# Altium schematic sheet AYBR3000.SchDoc
size A2
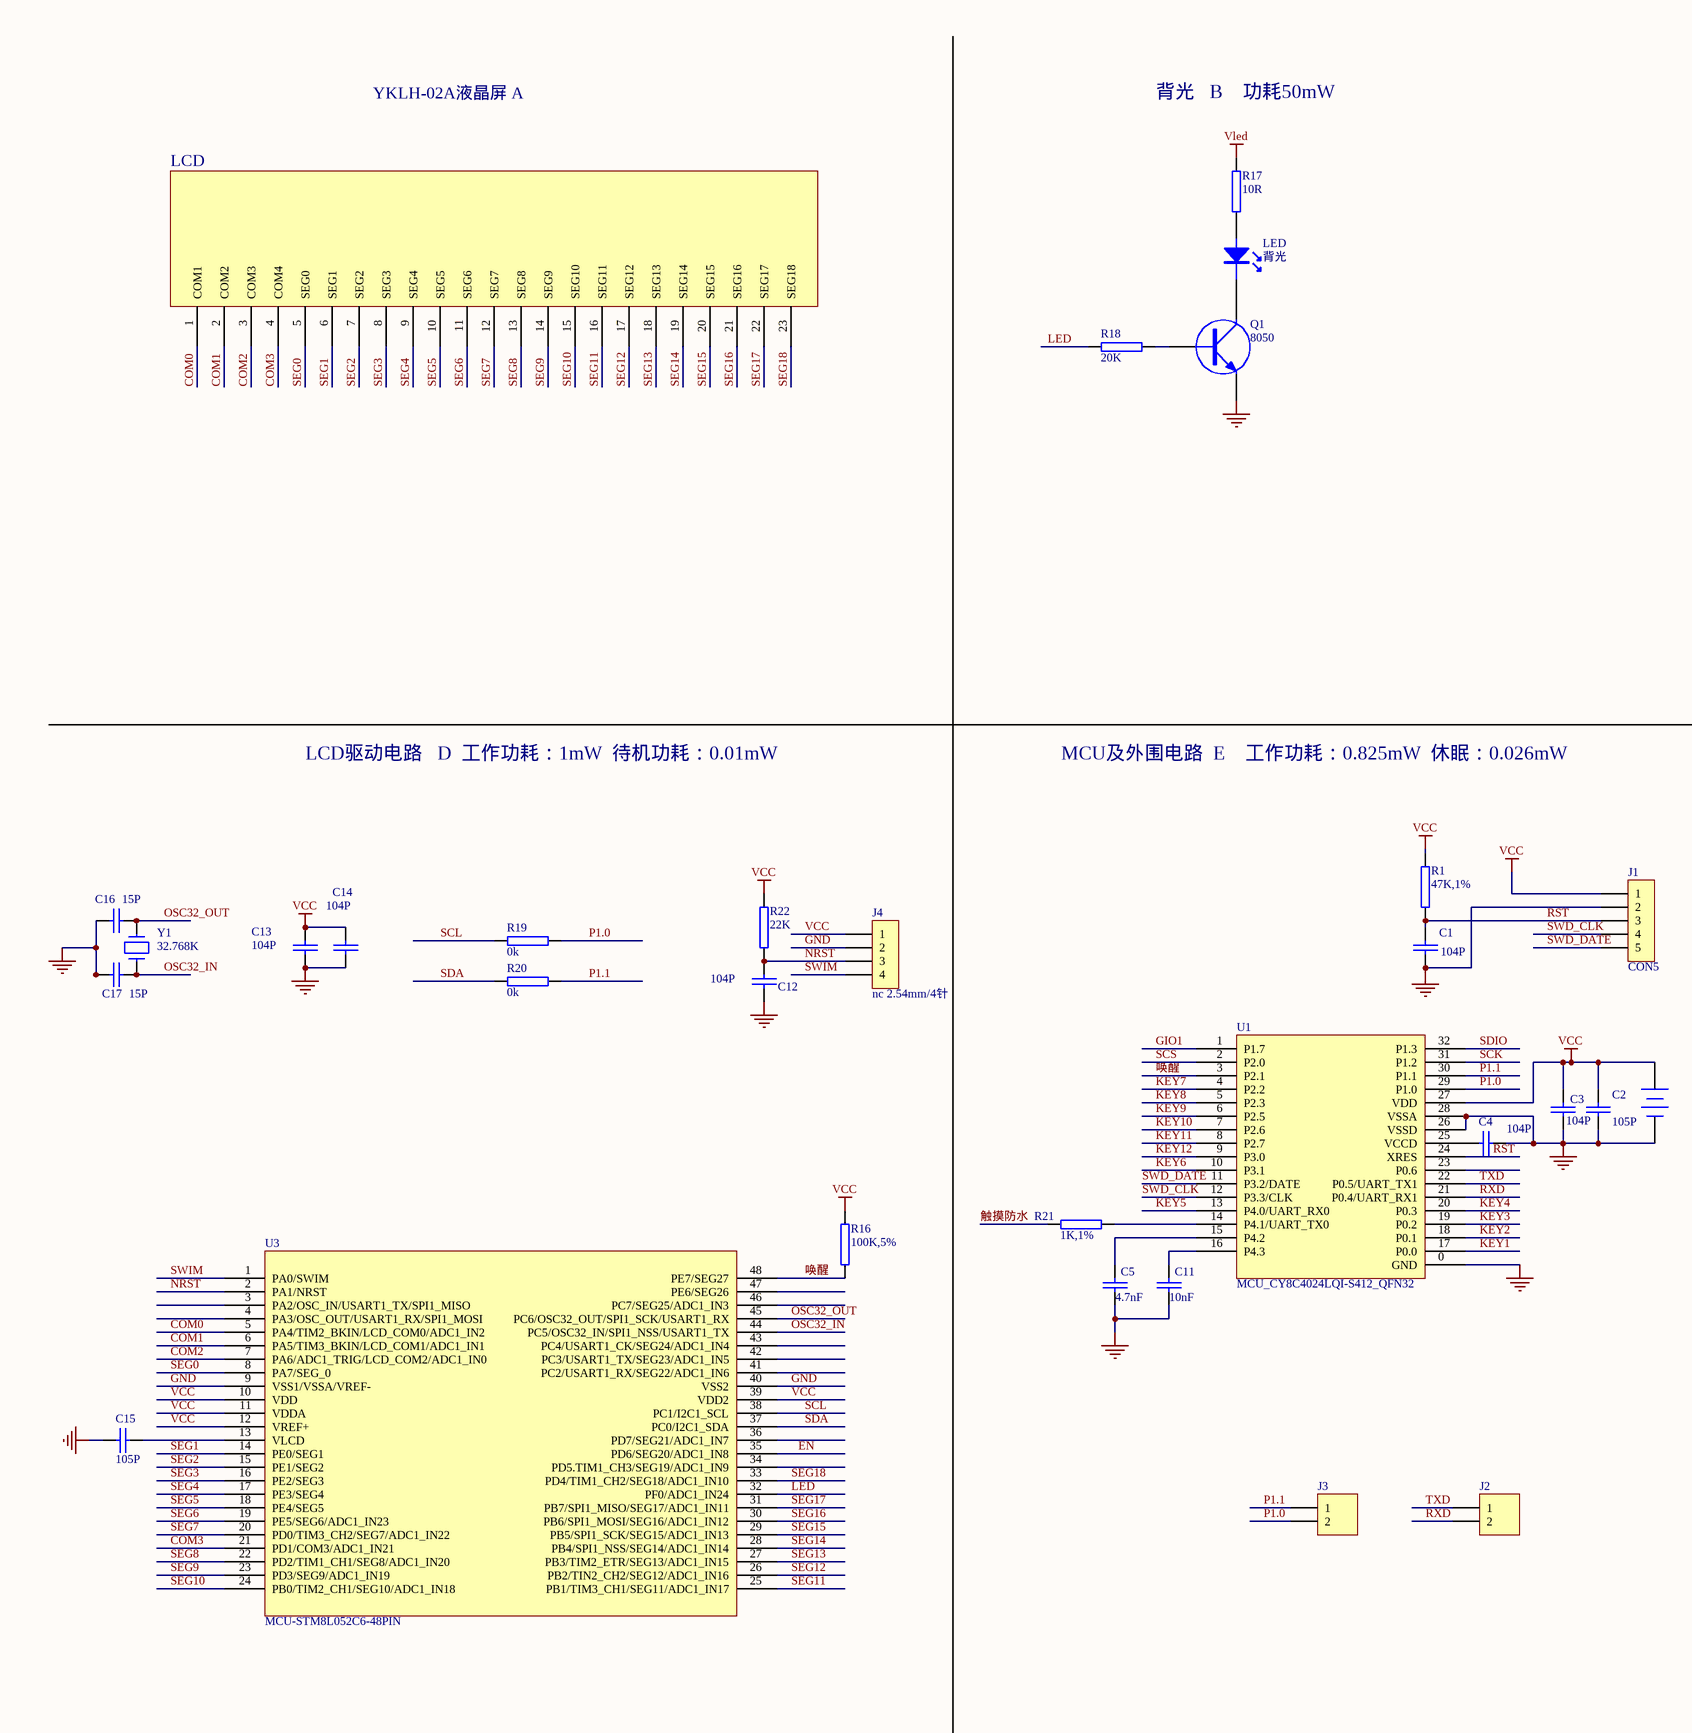
[diagram p0: AYBR3000.SchDoc, left]
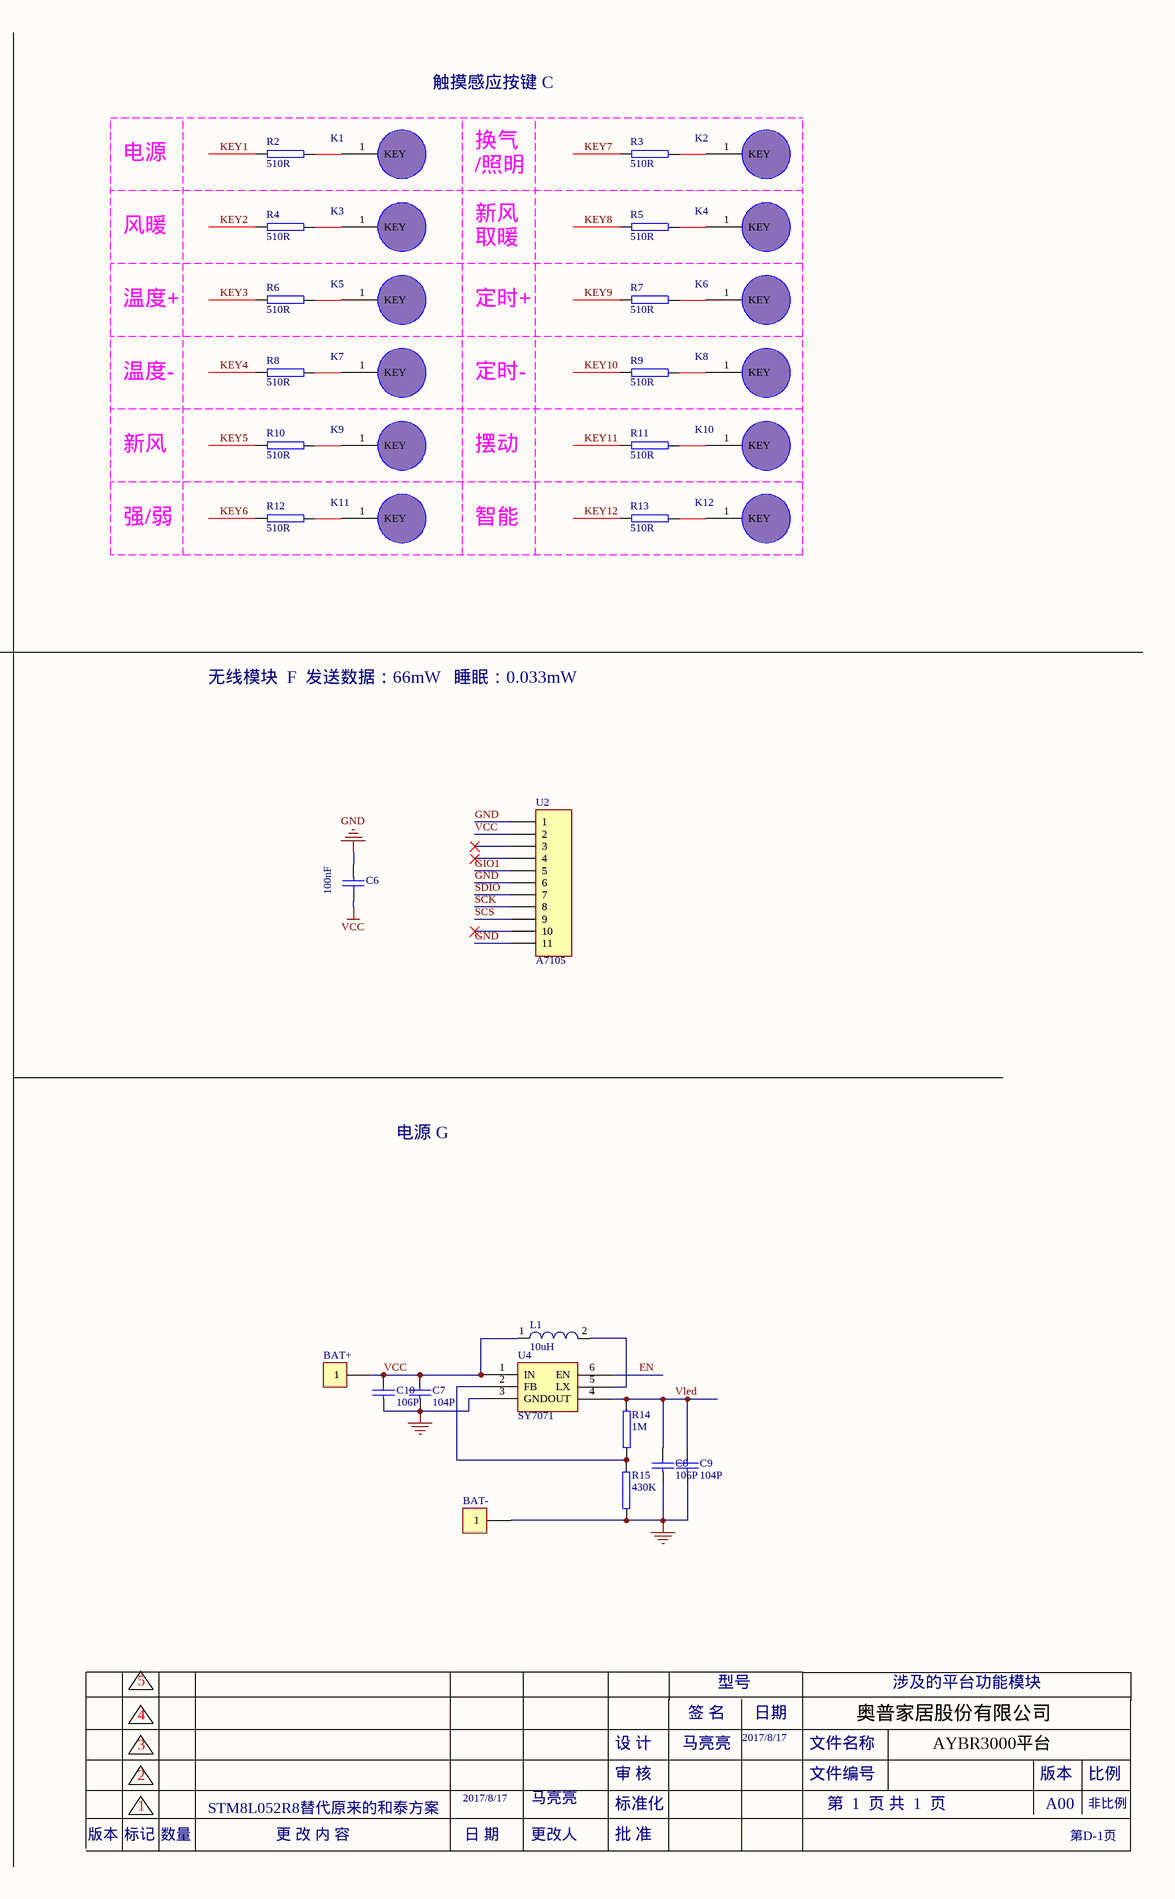
[diagram p1: AYBR3000.SchDoc, right]

## Parts
?  (no value)  [BAT-2]
BAT+  NC  [DOT]  (value not drawn)
BAT-  NC  [DOT]  (value not drawn)
C1  104P  [C0603-T]
C2  105P  [C0603-T]
C3  104P  [C0603-T]
C4  104P  [C0603-T]
C5  4.7nF  [C0603-T]
C6  100nF  [C0603-G]
C7  104P  [C0603-T]
C8  106P  [C0805-T]
C9  104P  [C0603-T]
C10  106P  [C0805-T]
C11  10nF  [C0603-T]
C12  104P  [0603]
C13  104P  [0603]
C14  104P  [0603]
C15  105P  [0603]
C16  15P  [0603]
C17  15P  [0603]
J1  CON5  [PZ-1*5-M-DO]
J2  (no value)  [SIP-2_54-2P]
J3  (no value)  [SIP-2_54-2P]
J4  nc 2.54mm/4针  [PZ-4]
K1  (no value)  [GYTH-YKLH-02A]
K2  (no value)  [GYTH-YKLH-02A]
K3  (no value)  [GYTH-YKLH-02A]
K4  (no value)  [GYTH-YKLH-02A]
K5  (no value)  [GYTH-YKLH-02A]
K6  (no value)  [GYTH-YKLH-02A]
K7  (no value)  [GYTH-YKLH-02A]
K8  (no value)  [GYTH-YKLH-02A]
K9  (no value)  [GYTH-YKLH-02A]
K10  (no value)  [GYTH-YKLH-02A]
K11  (no value)  [GYTH-YKLH-02A]
K12  (no value)  [GYTH-YKLH-02A]
L1  10uH  [L-2.0]
LCD  YKLH-02A液晶屏 A  [LCD-YKLH-02A]
LED  背光  [BLK-YKLH-02A-2]
Q1  8050  [SOT23-BEC-G]
R1  47K,1%  [R0603-T]
R2  510R  [R0603-T]
R3  510R  [R0603-T]
R4  510R  [R0603-T]
R5  510R  [R0603-T]
R6  510R  [R0603-T]
R7  510R  [R0603-T]
R8  510R  [R0603-T]
R9  510R  [R0603-T]
R10  510R  [R0603-T]
R11  510R  [R0603-T]
R12  510R  [R0603-T]
R13  510R  [R0603-T]
R14  1M  [R0603-T]
R15  430K  [R0603-T]
R16  100K,5%  [R0603-T]
R17  10R  [R1206-T]
R18  20K  [C0603-T]
R19  0k  [R0603-T]
R20  0k  [R0603-T]
R21  1K,1%  [R0603-T]
R22  22K  [0603]
U1  MCU_CY8C4024LQI-S412_QFN32  [QFN32-5*5]
U2  A7105  [MD7105-A04]
U3  MCU-STM8L052C6-48PIN  [LQFP48]
U4  SY7071  [SOT363]
Y1  32.768K  [XD-32.768K]

## Nets
GND: ?.2(-) BAT-.1 C1.2 C2.1 C3.1 C4.1 C5.1 C6.1 C7.1 C8.1 C9.1 C10.1 C11.1 C12.1 C13.1 C14.1 C15.2 C16.1 C17.1 J1.2 J4.2 Q1.E R15.1 U1.0(GND) U1.26(VSSD) U1.28(VSSA) U2.1 U2.6 U2.11 U3.9(VSS1/VSSA/VREF-) U3.40(VSS2) U4.3(GND)
VCC: ?.1(+) BAT+.1 C2.2 C3.2 C6.2 C7.2 C10.2 C13.2 C14.2 J1.1 J4.1 L1.1 R1.2 R16.1 R22.2 U1.27(VDD) U2.2 U3.10(VDD) U3.11(VDDA) U3.12(VREF+) U3.39(VDD2) U4.1(IN)
Vled: C8.2 C9.2 R14.1 R17.2 U4.4(OUT)
COM0: LCD.1(COM1) U3.5(PA4/TIM2_BKIN/LCD_COM0/ADC1_IN2)
COM1: LCD.2(COM2) U3.6(PA5/TIM3_BKIN/LCD_COM1/ADC1_IN1)
COM2: LCD.3(COM3) U3.7(PA6/ADC1_TRIG/LCD_COM2/ADC1_IN0)
COM3: LCD.4(COM4) U3.21(PD1/COM3/ADC1_IN21)
EN: U3.35(PD6/SEG20/ADC1_IN8) U4.6(EN)
GIO1: U1.1(P1.7) U2.5
KEY1: R2.2 U1.17(P0.0)
KEY2: R4.2 U1.18(P0.1)
KEY3: R6.2 U1.19(P0.2)
KEY4: R8.2 U1.20(P0.3)
KEY5: R10.2 U1.13(P4.0/UART_RX0)
KEY6: R12.2 U1.10(P3.1)
KEY7: R3.2 U1.4(P2.2)
KEY8: R5.2 U1.5(P2.3)
KEY9: R7.2 U1.6(P2.5)
KEY10: R9.2 U1.7(P2.6)
KEY11: R11.2 U1.8(P2.7)
KEY12: R13.2 U1.9(P3.0)
LED: R18.2 U3.32(PF0/ADC1_IN24)
NRST: C12.2 J4.3 R22.1 U3.2(PA1/NRST)
OSC32_IN: C17.2 U3.44(PC5/OSC32_IN/SPI1_NSS/USART1_TX) Y1.2
OSC32_OUT: C16.2 U3.45(PC6/OSC32_OUT/SPI1_SCK/USART1_RX) Y1.1
P1.0: J3.2 R19.1 U1.29(P1.0)
P1.1: J3.1 R20.1 U1.30(P1.1)
RST: C1.1 J1.3 R1.1 U1.24(XRES)
RXD: J2.2 U1.21(P0.4/UART_RX1)
SCK: U1.31(P1.2) U2.8
SCL: R19.2 U3.38(PC1/I2C1_SCL)
SCS: U1.2(P2.0) U2.9
SDA: R20.2 U3.37(PC0/I2C1_SDA)
SDIO: U1.32(P1.3) U2.7
SEG0: LCD.5(SEG0) U3.8(PA7/SEG_0)
SEG1: LCD.6(SEG1) U3.14(PE0/SEG1)
SEG2: LCD.7(SEG2) U3.15(PE1/SEG2)
SEG3: LCD.8(SEG3) U3.16(PE2/SEG3)
SEG4: LCD.9(SEG4) U3.17(PE3/SEG4)
SEG5: LCD.10(SEG5) U3.18(PE4/SEG5)
SEG6: LCD.11(SEG6) U3.19(PE5/SEG6/ADC1_IN23)
SEG7: LCD.12(SEG7) U3.20(PD0/TIM3_CH2/SEG7/ADC1_IN22)
SEG8: LCD.13(SEG8) U3.22(PD2/TIM1_CH1/SEG8/ADC1_IN20)
SEG9: LCD.14(SEG9) U3.23(PD3/SEG9/ADC1_IN19)
SEG10: LCD.15(SEG10) U3.24(PB0/TIM2_CH1/SEG10/ADC1_IN18)
SEG11: LCD.16(SEG11) U3.25(PB1/TIM3_CH1/SEG11/ADC1_IN17)
SEG12: LCD.17(SEG12) U3.26(PB2/TIN2_CH2/SEG12/ADC1_IN16)
SEG13: LCD.18(SEG13) U3.27(PB3/TIM2_ETR/SEG13/ADC1_IN15)
SEG14: LCD.19(SEG14) U3.28(PB4/SPI1_NSS/SEG14/ADC1_IN14)
SEG15: LCD.20(SEG15) U3.29(PB5/SPI1_SCK/SEG15/ADC1_IN13)
SEG16: LCD.21(SEG16) U3.30(PB6/SPI1_MOSI/SEG16/ADC1_IN12)
SEG17: LCD.22(SEG17) U3.31(PB7/SPI1_MISO/SEG17/ADC1_IN11)
SEG18: LCD.23(SEG18) U3.33(PD4/TIM1_CH2/SEG18/ADC1_IN10)
SWD_CLK: J1.4 U1.12(P3.3/CLK)
SWD_DATE: J1.5 U1.11(P3.2/DATE)
SWIM: J4.4 U3.1(PA0/SWIM)
TXD: J2.1 U1.22(P0.5/UART_TX1)
唤醒: R16.2 U1.3(P2.1) U3.48(PE7/SEG27)
触摸防水: R21.2
NetC4_2: C4.2 U1.25(VCCD)
NetC5_2: C5.2 U1.15(P4.2)
NetC11_2: C11.2 U1.16(P4.3)
NetC15_1: C15.1 U3.13(VLCD)
NetK1_1: K1.1(KEY) R2.1
NetK2_1: K2.1(KEY) R3.1
NetK3_1: K3.1(KEY) R4.1
NetK4_1: K4.1(KEY) R5.1
NetK5_1: K5.1(KEY) R6.1
NetK6_1: K6.1(KEY) R7.1
NetK7_1: K7.1(KEY) R8.1
NetK8_1: K8.1(KEY) R9.1
NetK9_1: K9.1(KEY) R10.1
NetK10_1: K10.1(KEY) R11.1
NetK11_1: K11.1(KEY) R12.1
NetK12_1: K12.1(KEY) R13.1
NetL1_2: L1.2 U4.5(LX)
NetLED_A: LED.A R17.1
NetLED_K: LED.K Q1.C
NetQ1_B: Q1.B R18.1
NetR14_2: R14.2 R15.2 U4.2(FB)
NetR21_1: R21.1 U1.14(P4.1/UART_TX0)

Not connected (* = marked no-connect by the designer): U1 23(P0.6); U2 3* 4* 10*; U3 3(PA2/OSC_IN/USART1_TX/SPI1_MISO) 4(PA3/OSC_OUT/USART1_RX/SPI1_MOSI) 34(PD5.TIM1_CH3/SEG19/ADC1_IN9) 36(PD7/SEG21/ADC1_IN7) 41(PC2/USART1_RX/SEG22/ADC1_IN6) 42(PC3/USART1_TX/SEG23/ADC1_IN5) 43(PC4/USART1_CK/SEG24/ADC1_IN4) 46(PC7/SEG25/ADC1_IN3) 47(PE6/SEG26)

## Notes on the sheet
- 背光   B    功耗50mW
- 触摸感应按键 C
- 电源
- 换气
- /照明
- 新风
- 风暖
- 取暖
- 温度+
- 定时+
- 温度-
- 定时-
- 摆动
- 强/弱
- 智能
- LCD驱动电路   D  工作功耗：1mW  待机功耗：0.01mW
- MCU及外围电路  E    工作功耗：0.825mW  休眠：0.026mW
- 无线模块  F  发送数据：66mW   睡眠：0.033mW
- 电源 G
- 5
- 4
- 签 名
- 型号
- 2017/8/17
- 日期
- 奥普家居股份有限公司
- 涉及的平台功能模块
- 2
- 3
- 马亮亮
- 设 计
- 审 核
- 文件名称
- 文件编号
- AYBR3000平台
- 版本
- 比例
- 非比例
- 标记
- 1
- 数量
- STM8L052R8替代原来的和泰方案
- 更 改 内 容
- 日 期
- 更改人
- 批 准
- 标准化
- 第  1  页 共  1  页
- A00
- 第D-1页

## Library data of the parts
? = Battery: Multicell Battery; Published: 24-Mar-1999; LatestRevisionDate: 17-Jul-2002; LatestRevisionNote: Re-released for DXP Platform.; PackageReference: BAT-2; Publisher: Altium Limited; PackageDescription: Battery; 2 Leads
BAT+ BAT- = CON1: Connector
C1-C5 C7-C17 = CAP: Capacitor
C6 = CAP
J1 = CON5: Connector
J2 J3 = CMA-6542PF: Header, 2-Pin
J4 = CON4: Connector
K1-K12 = KEY_TCH
L1 = L
LCD = YKLH-02A液晶屏
LED = LED
Q1 = NPN: NPN Transistor
R1-R22 = RES2
U2 = CON11: Connector
U3 = MCU-STM8L052C6
Y1 = CRYSTAL